# EasyEDA schematic section3.json
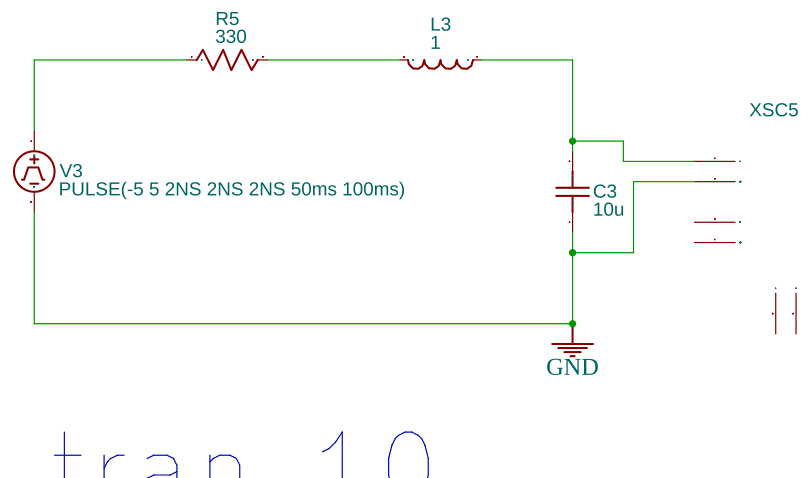
[diagram p0: schematic sheet]

## Parts
C3  10u  [RAD-0.1]
L3  1  [AXIAL-0.4]
R5  330  [AXIAL-0.3]
V3  PULSE(-5 5 2NS 2NS 2NS 50ms 100ms)  [HDR1X2]
XSC5  Oscilloscope

## Library data of the parts
C3 = Capacitor_US: Contributor: EasyEDA; Supplier: YUJING; Capacitance: 1u
L3 = Inductor: Supplier: YUJING; Contributor: EasyEDA; Inductance: 1m
R5 = Resistor_US: Resistance: 1k; Contributor: EasyEDA; Supplier: YUJING
V3 = VPULSE: Contributor: EasyEDA; sim: true
XSC5 = OSCILLOSCOPE: Contributor: EasyEDA; NameDisplay: 0; sim: true

## Nets
GND: C3.1 V3.2 XSC5.2(GND1)
Net-(C3-2): C3.2 L3.1 XSC5.1(A)
Net-(L3-2): L3.2 R5.2
Net-(R5-1): R5.1 V3.1

Not connected (* = marked no-connect by the designer): XSC5 3(B) 4(GND2) 5(T+) 6(T-)

## Notes on the sheet
- .tran 10
